# Altium schematic sheet Power Distribution.SchDoc
size A; SheetNumber: 8; SheetTotal: 8
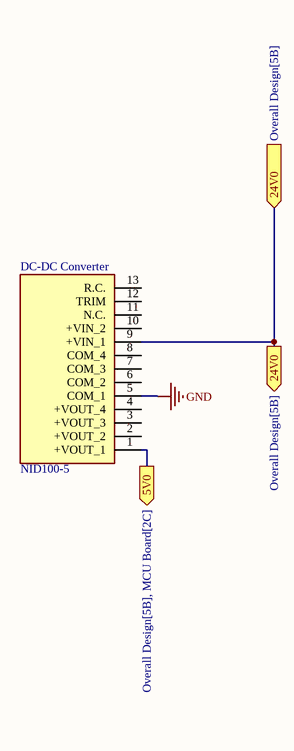
[diagram p0: Power Distribution.SchDoc]

## Parts
DC-DC_Converter  NID100-5  [NID1005]

## Ports
5V0 (out, see Overall Design[5B], MCU Board[2C]), 24V0 (in, see Overall Design[5B]), 24V0 (out, see Overall Design[5B])

## Nets
GND: DC-DC_Converter.5(COM_1)
5V0: DC-DC_Converter.1(+VOUT_1) ; port 5V0
24V0: DC-DC_Converter.9(+VIN_1) ; port 24V0

Not connected (* = marked no-connect by the designer): DC-DC_Converter 2(+VOUT_2) 3(+VOUT_3) 4(+VOUT_4) 6(COM_2) 7(COM_3) 8(COM_4) 10(+VIN_2) 11(N.C.) 12(TRIM) 13(R.C.)

## Library data of the parts
DC-DC_Converter = NID100-5: Power Supply; Manufacturer_Name: Mean Well; Datasheet Link: https://www.meanwell-web.com/content/files/pdfs/productPdfs/MW/NID100/NID100-spec.pdf; Height: 27.5mm; Manufacturer_Part_Number: NID100-5; Mouser Part Number: 709-NID100-5; Mouser Price/Stock: https://www.mouser.co.uk/ProductDetail/MEAN-WELL/NID100-5?qs=u16ybLDytRY%252BLs2ghdXN4Q%3D%3D; Arrow Part Number: NID100-5; Arrow Price/Stock: https://www.arrow.com/en/products/nid100-5/mean-well-enterprises?region=nac